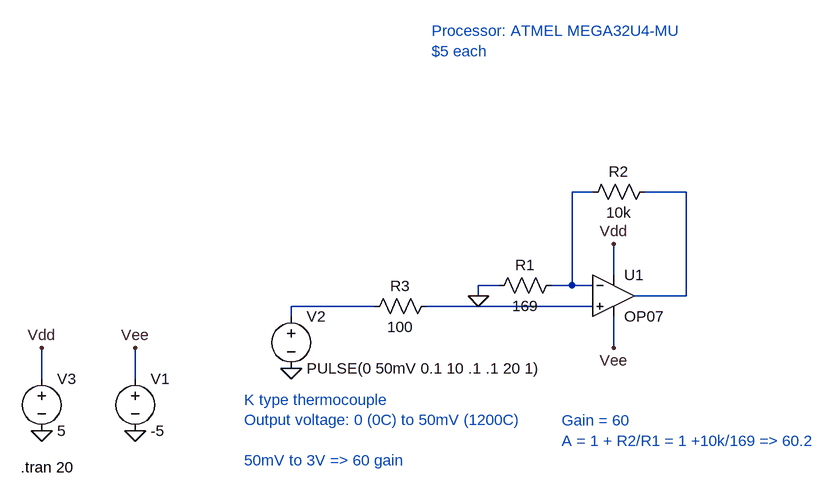
[diagram p0: schematic thermocouple_buffer.asc]
thermocouple_buffer.asc, the LTspice schematic file:
Version 4
SHEET 1 880 744
WIRE 304 304 272 304
WIRE 448 304 384 304
WIRE 336 432 336 384
WIRE 160 448 128 448
WIRE 272 448 272 304
WIRE 272 448 240 448
WIRE 304 448 272 448
WIRE 128 464 128 448
WIRE 448 464 448 304
WIRE 448 464 368 464
WIRE -32 480 -160 480
WIRE 304 480 48 480
WIRE -160 496 -160 480
WIRE 336 544 336 496
WIRE -544 592 -544 544
WIRE -400 592 -400 544
FLAG -400 672 0
FLAG -400 544 Vee
FLAG 336 384 Vdd
FLAG -160 576 0
FLAG 128 464 0
FLAG -544 672 0
FLAG -544 544 Vdd
FLAG 336 544 Vee
SYMBOL OpAmps\\OP07 336 400 R0
SYMATTR InstName U1
SYMBOL voltage -400 576 R0
WINDOW 123 0 0 Left 0
WINDOW 39 0 0 Left 0
SYMATTR InstName V1
SYMATTR Value -5
SYMBOL voltage -160 480 R0
WINDOW 123 0 0 Left 0
WINDOW 39 0 0 Left 0
SYMATTR InstName V2
SYMATTR Value PULSE(0 50mV 0.1 10 .1 .1 20 1)
SYMBOL res 144 464 R270
WINDOW 0 32 56 VTop 2
WINDOW 3 0 56 VBottom 2
SYMATTR InstName R1
SYMATTR Value 169
SYMBOL res 288 320 R270
WINDOW 0 32 56 VTop 2
WINDOW 3 0 56 VBottom 2
SYMATTR InstName R2
SYMATTR Value 10k
SYMBOL res 64 464 R90
WINDOW 0 0 56 VBottom 2
WINDOW 3 32 56 VTop 2
SYMATTR InstName R3
SYMATTR Value 100
SYMBOL voltage -544 576 R0
WINDOW 123 0 0 Left 0
WINDOW 39 0 0 Left 0
SYMATTR InstName V3
SYMATTR Value 5
TEXT 56 56 Left 2 ;Processor: ATMEL MEGA32U4-MU\n$5 each
TEXT -232 624 Left 2 ;K type thermocouple\nOutput voltage: 0 (0C) to 50mV (1200C)\n \n50mV to 3V => 60 gain
TEXT 256 656 Left 2 ;Gain = 60\nA = 1 + R2/R1 = 1 +10k/169 => 60.2
TEXT -576 728 Left 2 !.tran 20

The netlist it stands for:
* thermocouple_buffer.asc
XU1 N004 N001 Vdd Vee N002 LT1001  ; OP07, pins In+ In- V+ V- OUT
V1 Vee 0 -5
V2 N003 0 PULSE(0 50mV 0.1 10 .1 .1 20 1)
R1 0 N001 169
R2 N001 N002 10k
R3 N004 N003 100
V3 Vdd 0 5
* Processor: ATMEL MEGA32U4-MU
* $5 each
* K type thermocouple
* Output voltage: 0 (0C) to 50mV (1200C)
* 50mV to 3V => 60 gain
* Gain = 60
* A = 1 + R2/R1 = 1 +10k/169 => 60.2
.tran 20
.lib LTC.lib
.backanno
.end